# EAGLE schematic distillerone (EAGLE 9.6.2)
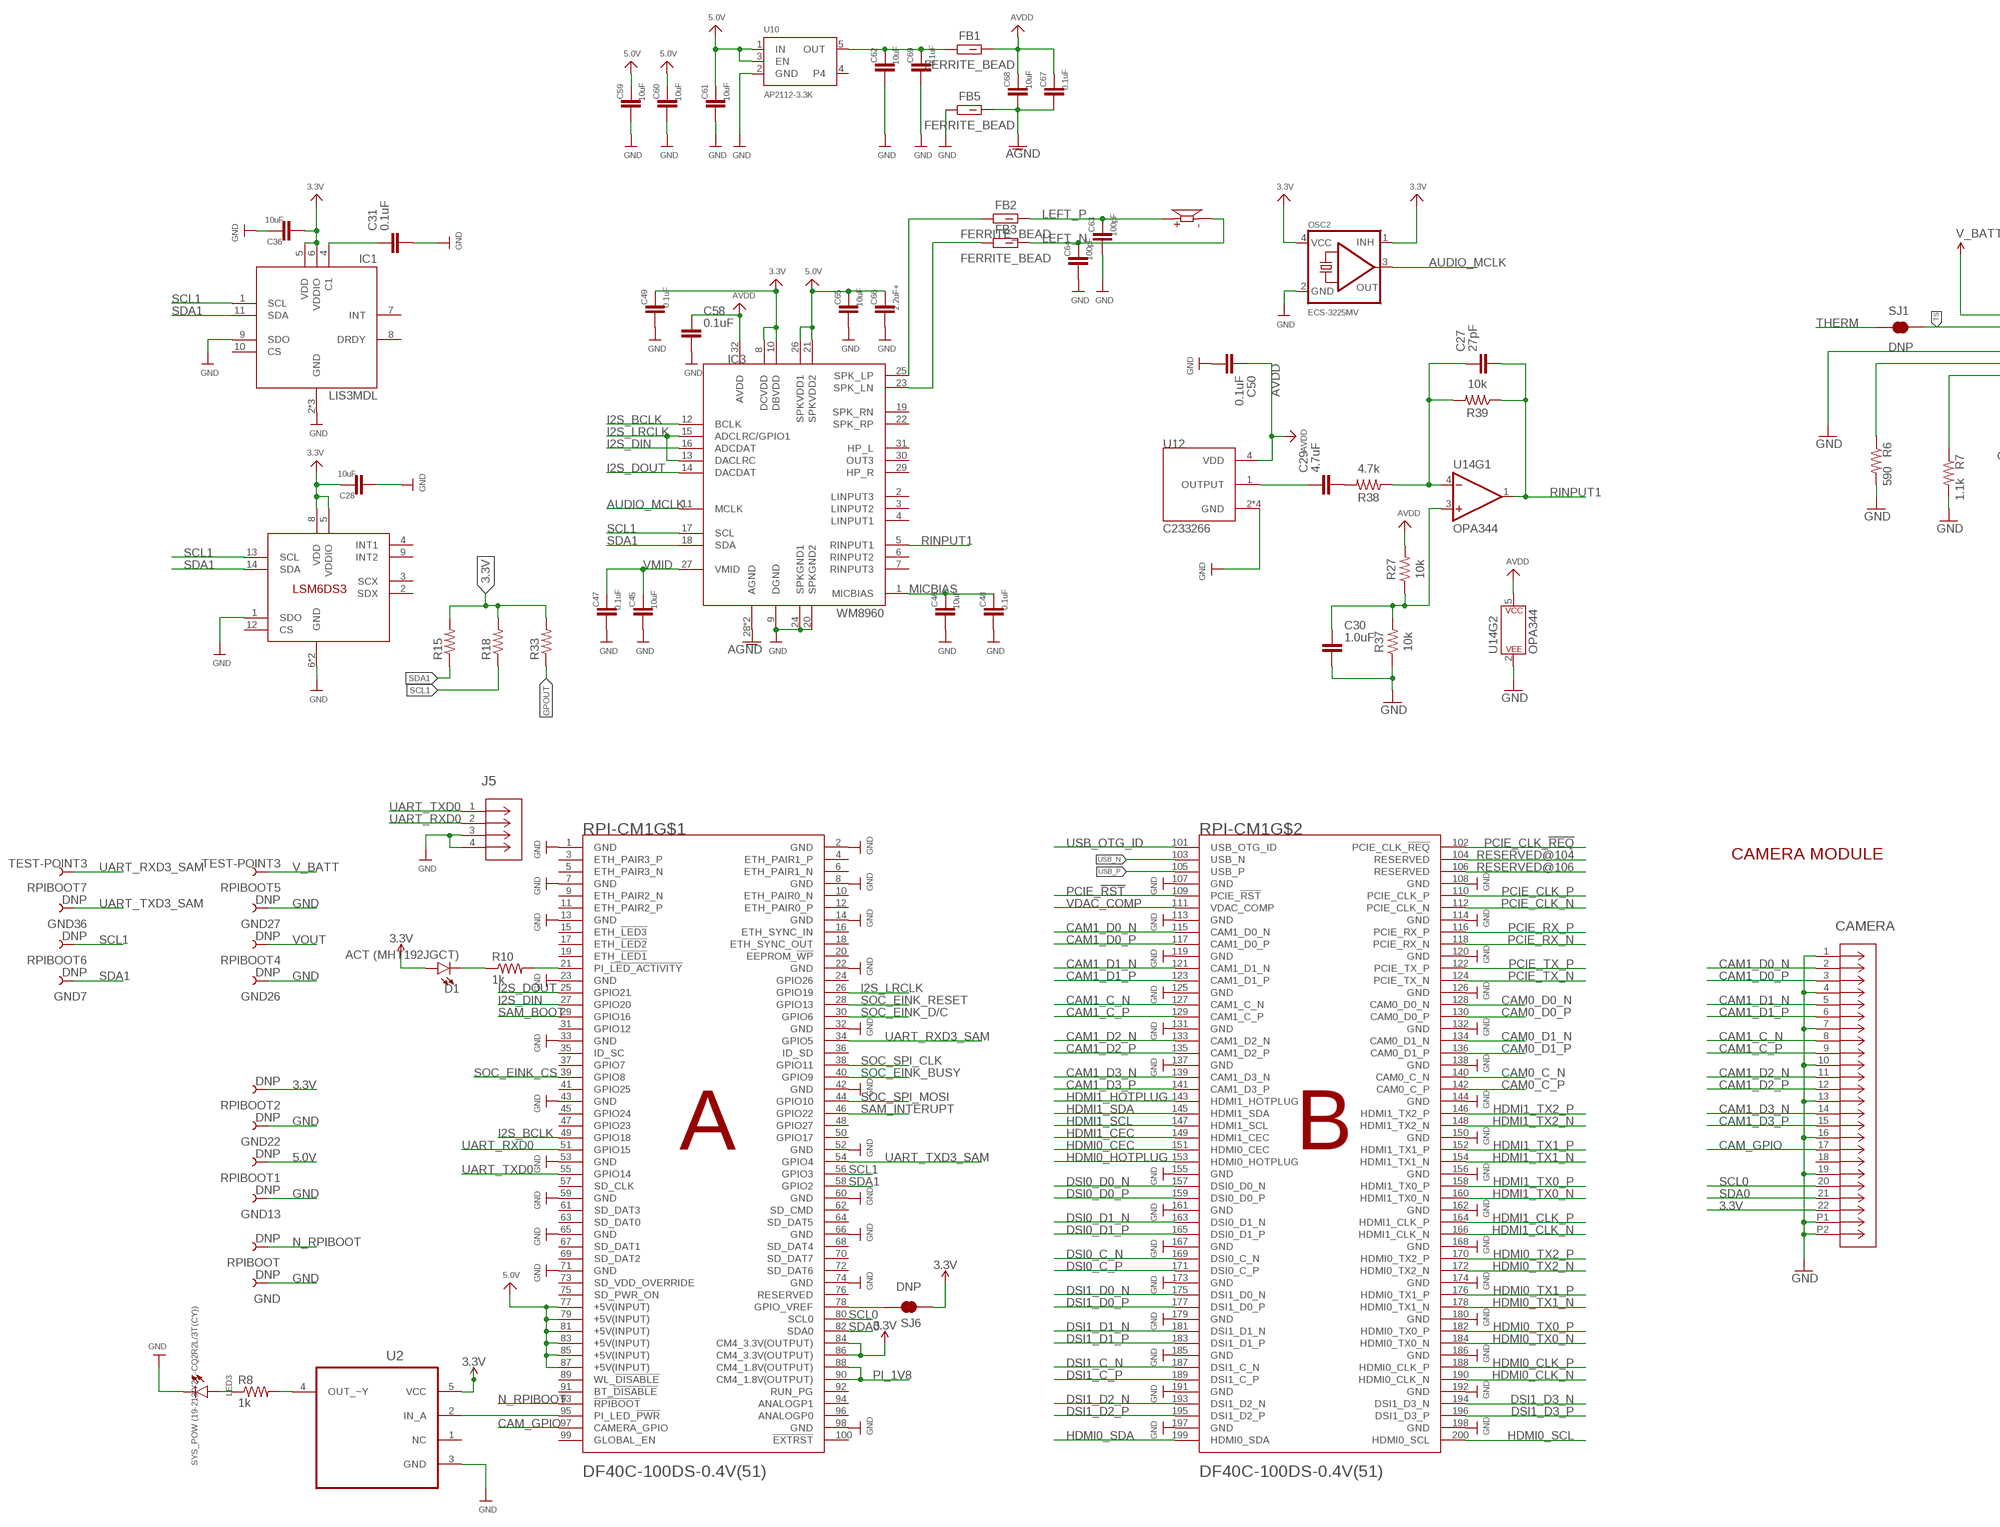
[diagram p0: schematic, sheet 1, part 1 of 3]
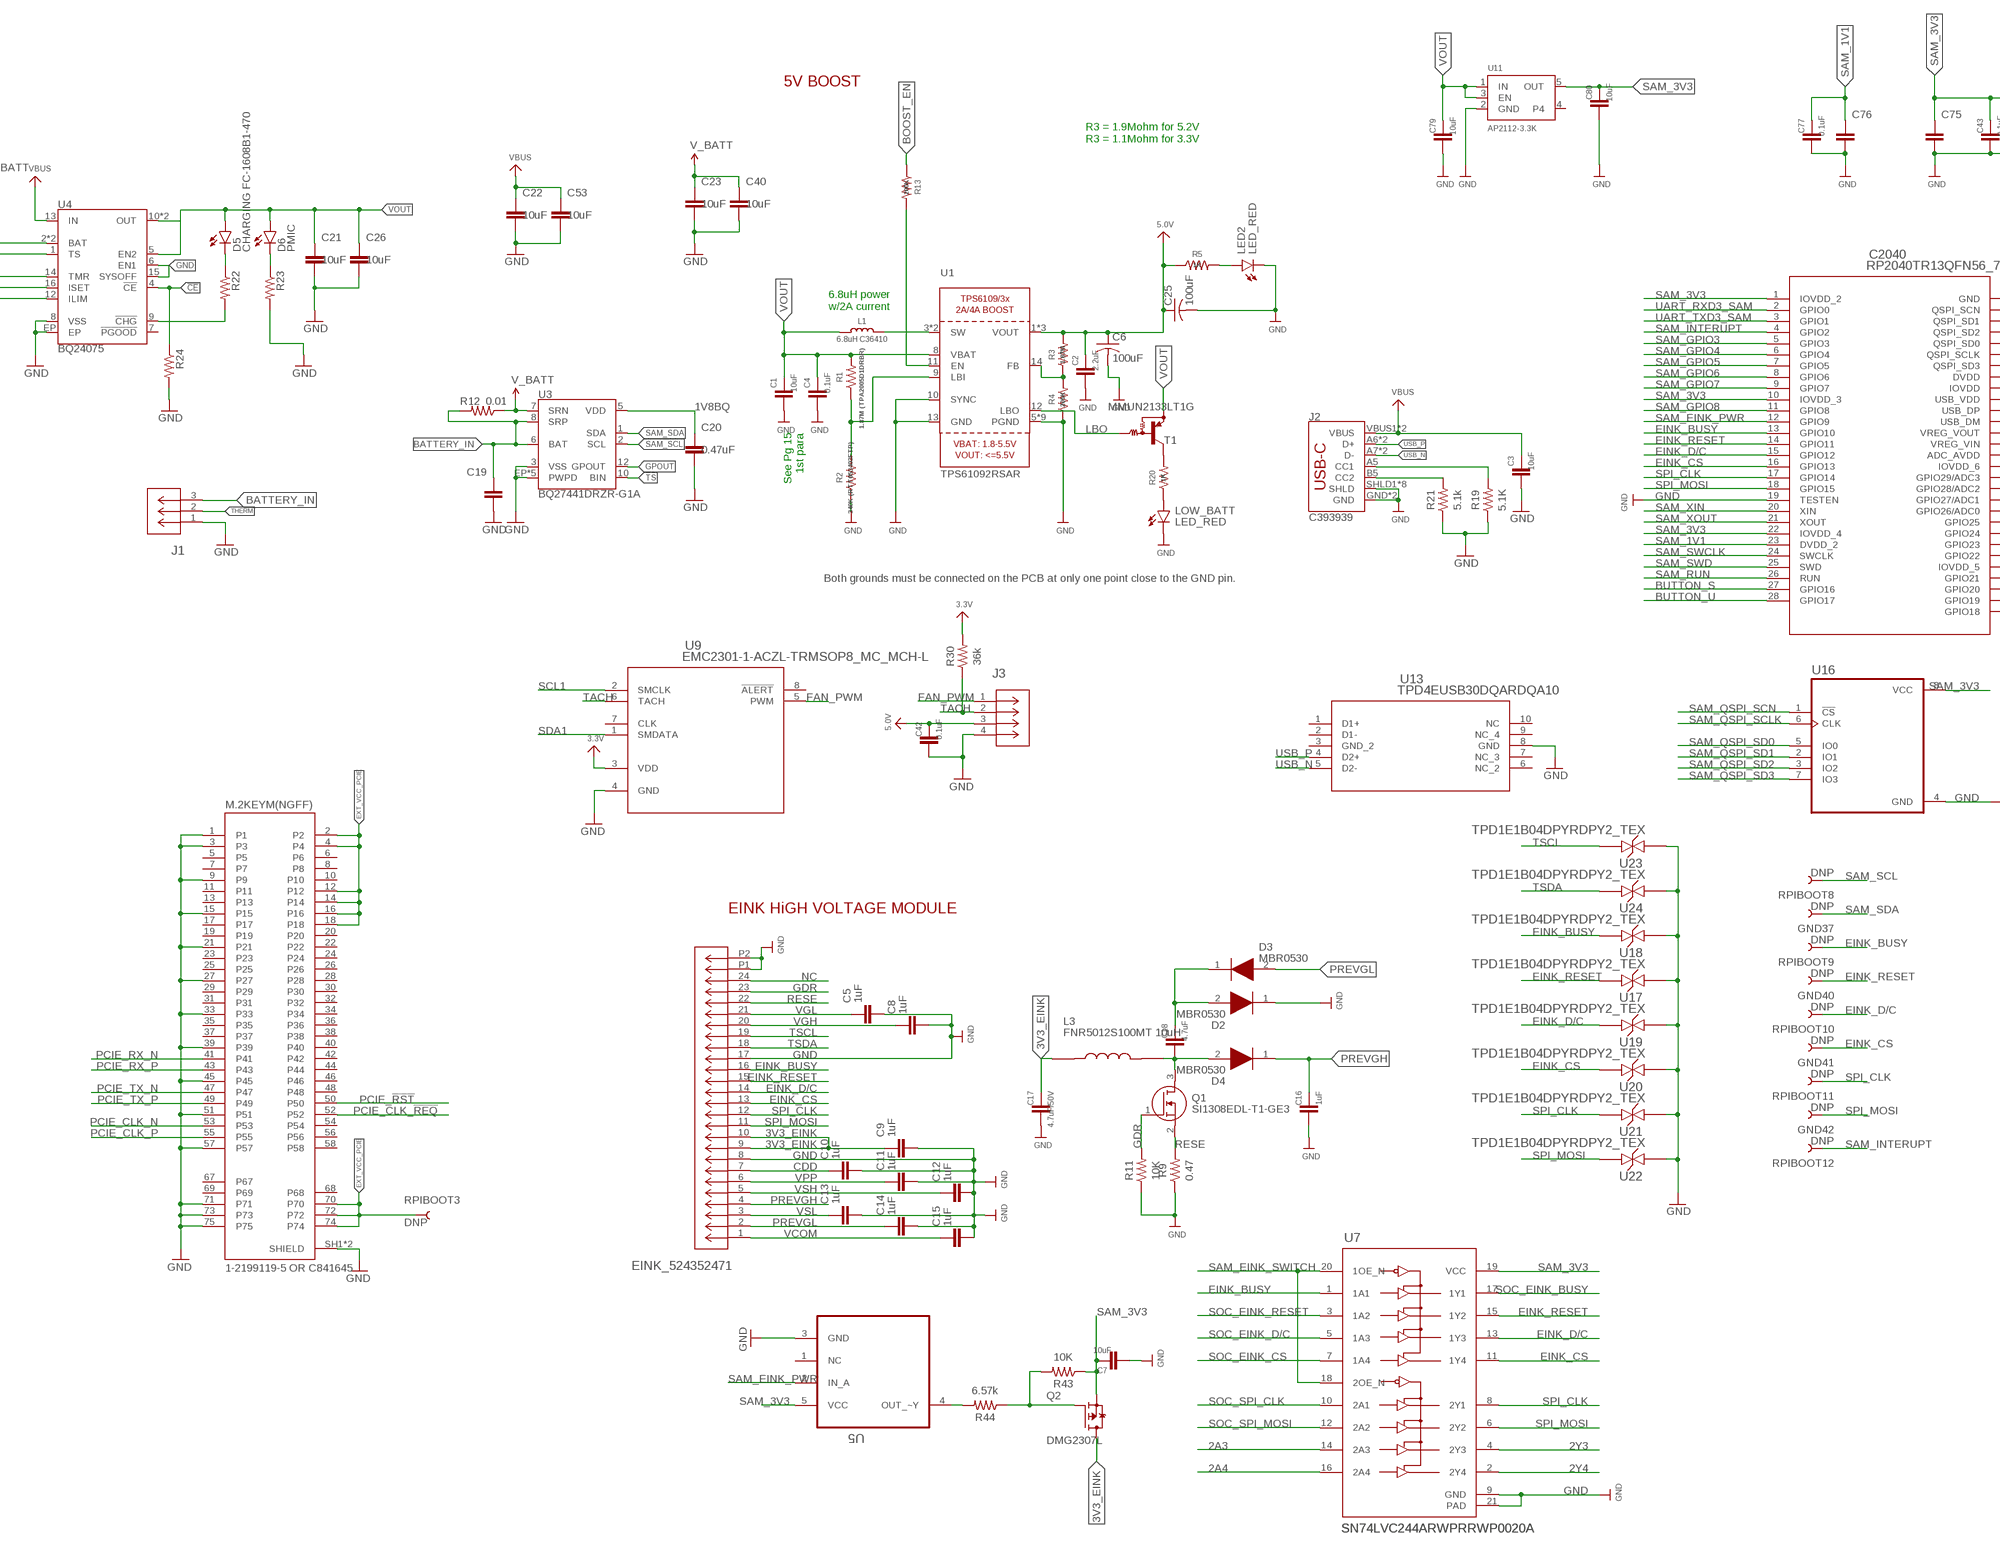
[diagram p1: schematic, sheet 1, part 2 of 3]
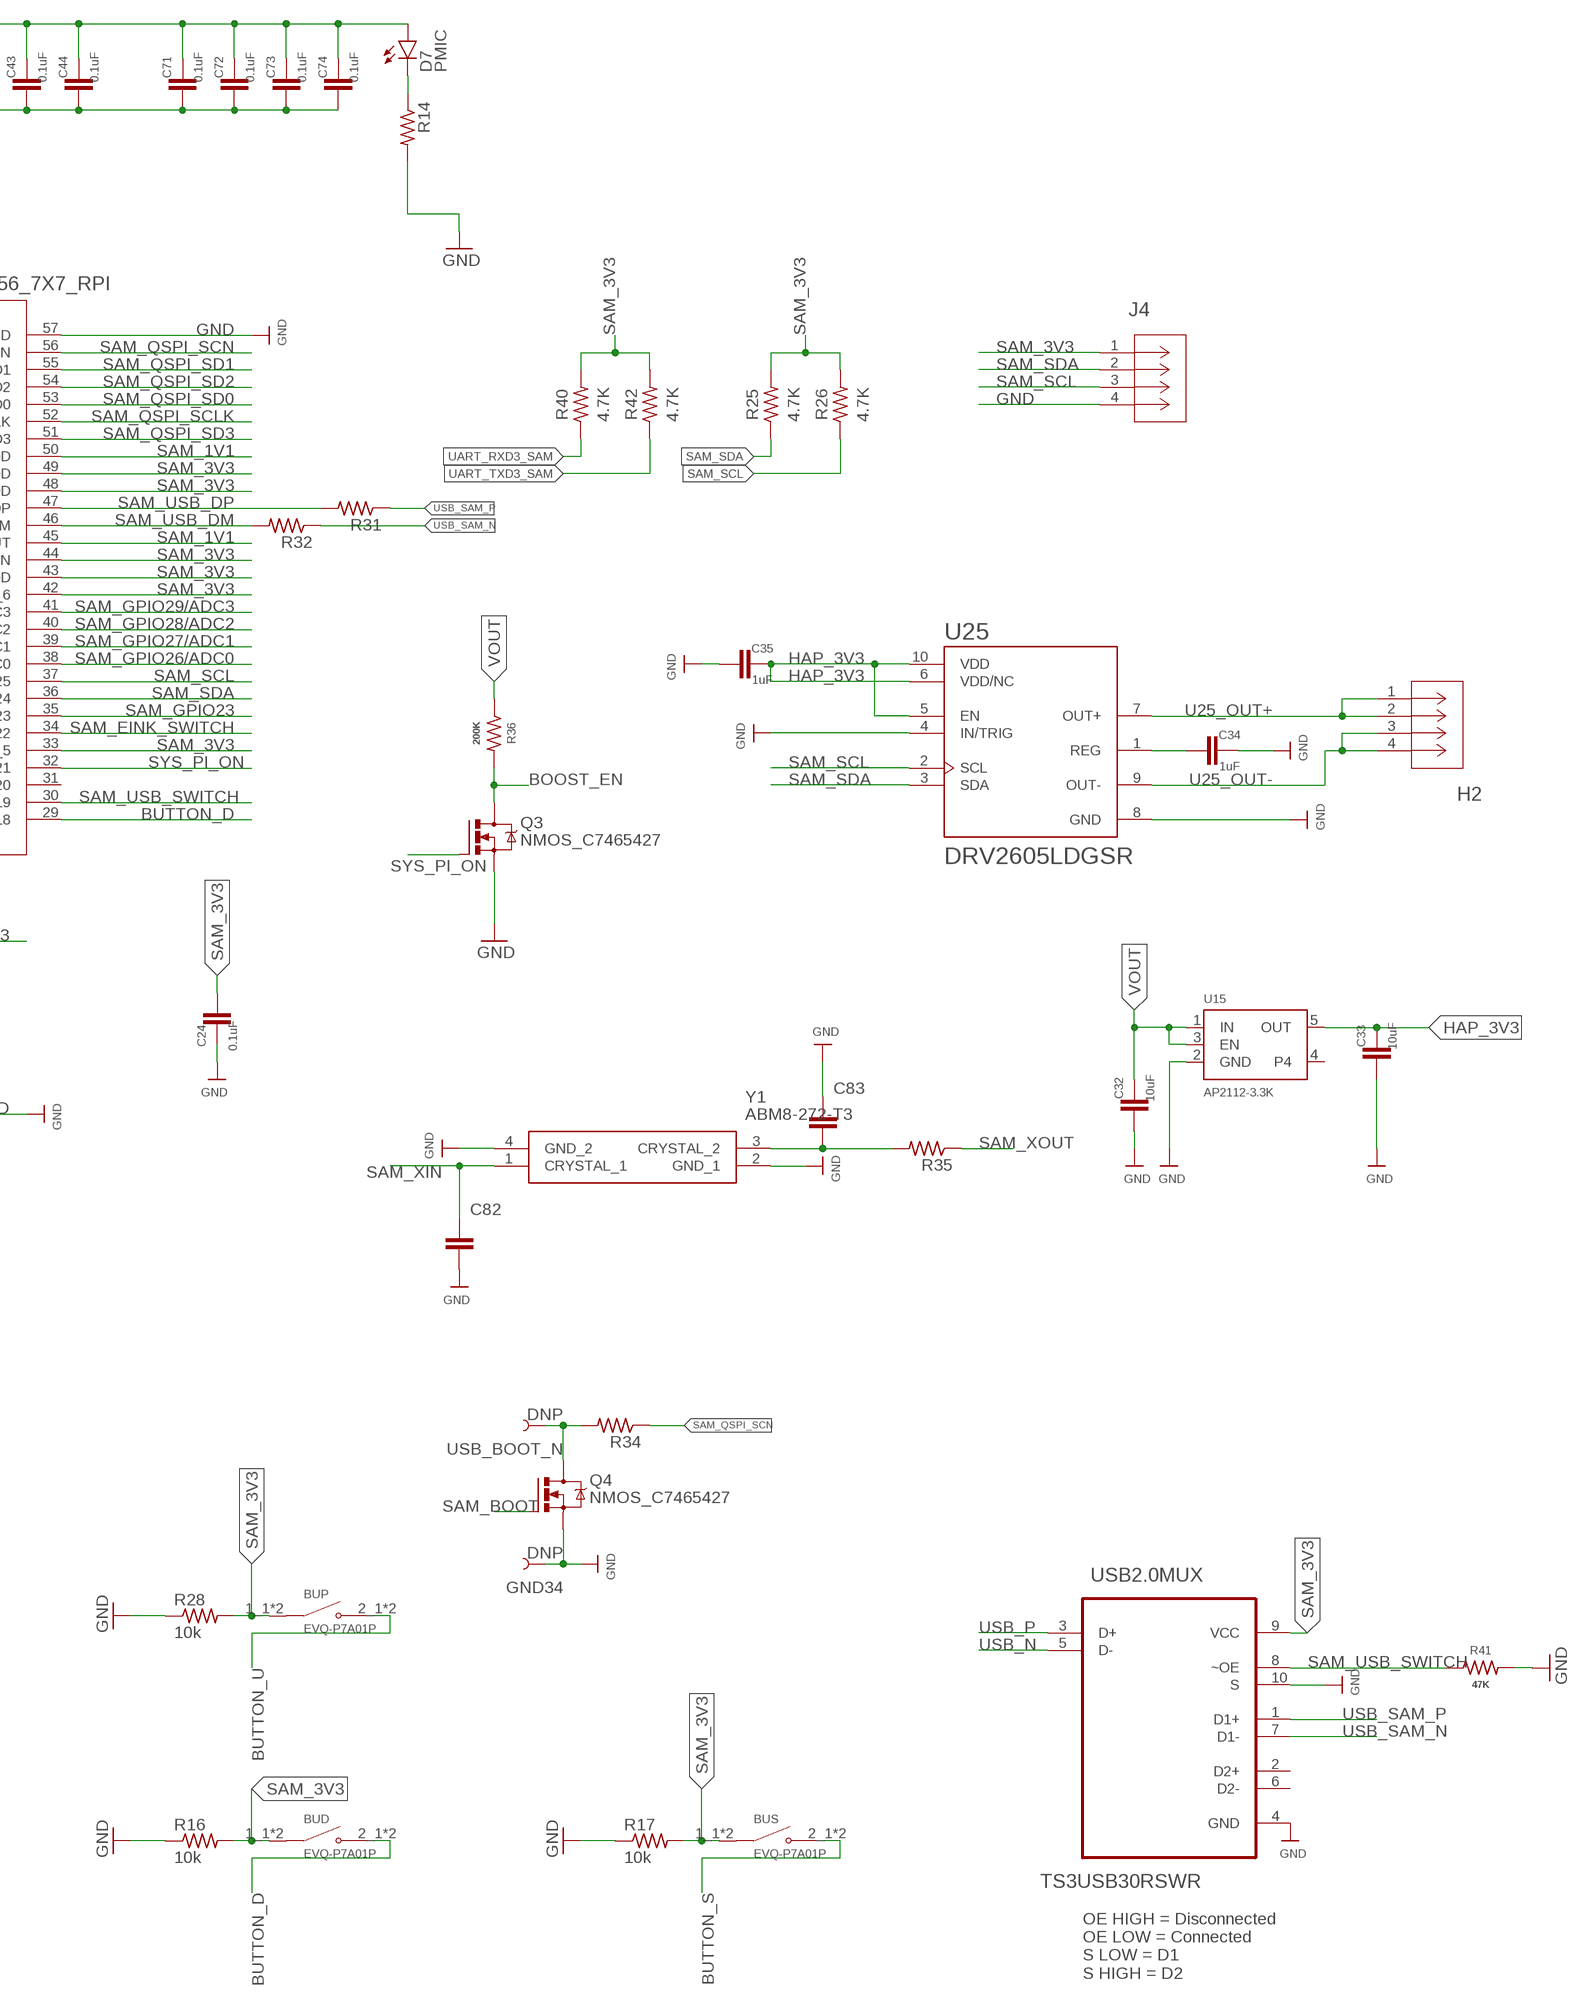
[diagram p2: schematic, sheet 1, part 3 of 3]

## Parts
BUD  EVQ-P7A01P  [SW_EVQ-P7A01P]
BUP  EVQ-P7A01P  [SW_EVQ-P7A01P]
BUS  EVQ-P7A01P  [SW_EVQ-P7A01P]
C1  10uF  C_CHIP-0402(1005-METRIC)  [CAPC1005X60]
C2  2.2uF  C_CHIP-0402(1005-METRIC)  [CAPC1005X60]
C3  10uF  C_CHIP-0402(1005-METRIC)  [CAPC1005X60]
C4  0.1uF  C_CHIP-0402(1005-METRIC)  [CAPC1005X60]
C5  1uF  C_CHIP-0402(1005-METRIC)  [CAPC1005X60]
C6  100uF  C-USC1210  [C1210]
C7  10uF  C_CHIP-0402(1005-METRIC)  [CAPC1005X60]
C8  1uF  C_CHIP-0402(1005-METRIC)  [CAPC1005X60]
C9  1uF  C_CHIP-0402(1005-METRIC)  [CAPC1005X60]
C10  1uF  C_CHIP-0402(1005-METRIC)  [CAPC1005X60]
C11  1uF  C_CHIP-0402(1005-METRIC)  [CAPC1005X60]
C12  1uF  C_CHIP-0402(1005-METRIC)  [CAPC1005X60]
C13  1uF  C_CHIP-0402(1005-METRIC)  [CAPC1005X60]
C14  1uF  C_CHIP-0402(1005-METRIC)  [CAPC1005X60]
C15  1uF  C_CHIP-0402(1005-METRIC)  [CAPC1005X60]
C16  1uF  C_CHIP-0402(1005-METRIC)  [CAPC1005X60]
C17  4.7uF/50V  C_CHIP-0402(1005-METRIC)  [CAPC1005X60]
C18  4.7uF  C_CHIP-0603(1608-METRIC)  [CAPC1608X85]
C19  1.0uF  C_CHIP-0402(1005-METRIC)  [CAPC1005X60]
C20  0.47uF  C_CHIP-0402(1005-METRIC)  [CAPC1005X60]
C21  10uF  C_CHIP-0402(1005-METRIC)  [CAPC1005X60]
C22  10uF  C_CHIP-0402(1005-METRIC)  [CAPC1005X60]
C23  10uF  C_CHIP-0402(1005-METRIC)  [CAPC1005X60]
C24  0.1uF  C_CHIP-0402(1005-METRIC)  [CAPC1005X60]
C25  100uF  C-USC1210  [C1210]
C26  10uF  C_CHIP-0402(1005-METRIC)  [CAPC1005X60]
C27  27pF  C_CHIP-0402(1005-METRIC)  [CAPC1005X60]
C28  10uF  C_CHIP-0402(1005-METRIC)  [CAPC1005X60]
C29  4.7uF  C_CHIP-0402(1005-METRIC)  [CAPC1005X60]
C30  1.0uF  C_CHIP-0402(1005-METRIC)  [CAPC1005X60]
C31  0.1uF  C_CHIP-0402(1005-METRIC)  [CAPC1005X60]
C32  10uF  C_CHIP-0402(1005-METRIC)  [CAPC1005X60]
C33  10uF  C_CHIP-0402(1005-METRIC)  [CAPC1005X60]
C34  1uF  C_CHIP-0402(1005-METRIC)  [CAPC1005X60]
C35  1uF  C_CHIP-0402(1005-METRIC)  [CAPC1005X60]
C36  10uF  C_CHIP-0402(1005-METRIC)  [CAPC1005X60]
C40  10uF  C_CHIP-0402(1005-METRIC)  [CAPC1005X60]
C42  0.1uF  C_CHIP-0603(1608-METRIC)  [CAPC1608X85]
C43  0.1uF  C_CHIP-0402(1005-METRIC)  [CAPC1005X60]
C44  0.1uF  C_CHIP-0402(1005-METRIC)  [CAPC1005X60]
C45  10uF  C_CHIP-0402(1005-METRIC)  [CAPC1005X60]
C46  10uF  C_CHIP-0402(1005-METRIC)  [CAPC1005X60]
C47  0.1uF  C_CHIP-0402(1005-METRIC)  [CAPC1005X60]
C48  0.1uF  C_CHIP-0402(1005-METRIC)  [CAPC1005X60]
C49  0.1uF  C_CHIP-0402(1005-METRIC)  [CAPC1005X60]
C50  0.1uF  C_CHIP-0402(1005-METRIC)  [CAPC1005X60]
C53  10uF  C_CHIP-0402(1005-METRIC)  [CAPC1005X60]
C58  0.1uF  C_CHIP-0402(1005-METRIC)  [CAPC1005X60]
C59  10uF  C_CHIP-0402(1005-METRIC)  [CAPC1005X60]
C60  10uF  C_CHIP-0402(1005-METRIC)  [CAPC1005X60]
C61  10uF  C_CHIP-0402(1005-METRIC)  [CAPC1005X60]
C62  10uF  C_CHIP-0402(1005-METRIC)  [CAPC1005X60]
C63  100pF  C_CHIP-0402(1005-METRIC)  [CAPC1005X60]
C64  100pF  C_CHIP-0402(1005-METRIC)  [CAPC1005X60]
C65  10uF  C_CHIP-0402(1005-METRIC)  [CAPC1005X60]
C66  2.2uF+  C_CHIP-0402(1005-METRIC)  [CAPC1005X60]
C67  0.1uF  C_CHIP-0402(1005-METRIC)  [CAPC1005X60]
C68  10uF  C_CHIP-0402(1005-METRIC)  [CAPC1005X60]
C69  0.1uF  C_CHIP-0402(1005-METRIC)  [CAPC1005X60]
C71  0.1uF  C_CHIP-0402(1005-METRIC)  [CAPC1005X60]
C72  0.1uF  C_CHIP-0402(1005-METRIC)  [CAPC1005X60]
C73  0.1uF  C_CHIP-0402(1005-METRIC)  [CAPC1005X60]
C74  0.1uF  C_CHIP-0402(1005-METRIC)  [CAPC1005X60]
C75  1.0uF  C_CHIP-0402(1005-METRIC)  [CAPC1005X60]
C76  1.0uF  C_CHIP-0402(1005-METRIC)  [CAPC1005X60]
C77  0.1uF  C_CHIP-0402(1005-METRIC)  [CAPC1005X60]
C79  10uF  C_CHIP-0402(1005-METRIC)  [CAPC1005X60]
C80  10uF  C_CHIP-0402(1005-METRIC)  [CAPC1005X60]
C82  15p  C_CHIP-0402(1005-METRIC)  [CAPC1005X60]
C83  15p  C_CHIP-0402(1005-METRIC)  [CAPC1005X60]
C2040  RP2040TR13QFN56_7X7_RPI  [QFN56_7X7_RPI]
CAMERA  C262642  524372271CON_524372271_MOL  [CON_524372271_MOL]
D1  ACT (MHT192JGCT)  LED-GREEN0603  [LED-0603@1]
D2  MBR0530  [SOD3716X135N]
D3  MBR0530  [SOD3716X135N]
D4  MBR0530  [SOD3716X135N]
D5  CHARGING FC-1608B1-470  LED-BLUE0603  [LED-0603]
D6  PMIC  LED-RED0603  [LED-0603]
D7  PMIC  LED-RED0603  [LED-0603]
EINK_524352471  524372471  524372471CON_524372471_MOL  [CON_524372471_MOL]
FB1  FERRITE_BEAD  FBCHIP-0603(1608-METRIC)  [BEADC1608X95N]
FB2  FERRITE_BEAD  FBCHIP-0603(1608-METRIC)  [BEADC1608X95N]
FB3  FERRITE_BEAD  FBCHIP-0603(1608-METRIC)  [BEADC1608X95N]
FB5  FERRITE_BEAD  FBCHIP-0603(1608-METRIC)  [BEADC1608X95N]
GND  DNP  TEST-POINT3  [PAD.03X.03]
GND7  DNP  TEST-POINT3  [PAD.03X.03]
GND13  DNP  TEST-POINT3  [PAD.03X.03]
GND22  DNP  TEST-POINT3  [PAD.03X.03]
GND26  DNP  TEST-POINT3  [PAD.03X.03]
GND27  DNP  TEST-POINT3  [PAD.03X.03]
GND34  DNP  TEST-POINT3  [PAD.03X.03]
GND36  DNP  TEST-POINT3  [PAD.03X.03]
GND37  DNP  TEST-POINT3  [PAD.03X.03]
GND40  DNP  TEST-POINT3  [PAD.03X.03]
GND41  DNP  TEST-POINT3  [PAD.03X.03]
GND42  DNP  TEST-POINT3  [PAD.03X.03]
H2  BM04B-SRSS-TBCONN4_BM04B-SRSS_JST  [CONN4_BM04B-SRSS_JST]
IC1  LIS3MDL  [LGA12_2X2MM]
IC3  WM8960  [QFN32_5MM]
J1  SM03B-SRSS-TBCONN_SM03B-SRSS-TB_JST  [CONN_SM03B-SRSS-TB_JST]
J2  C393939  USB_C16PIN  [USB-C-16P]
J3  BM04B-SRSS-TBCONN4_BM04B-SRSS_JST  [CONN4_BM04B-SRSS_JST]
J4  BM04B-SRSS-TBCONN4_BM04B-SRSS_JST  [CONN4_BM04B-SRSS_JST]
J5  BM04B-SRSS-TBCONN4_BM04B-SRSS_JST  [CONN4_BM04B-SRSS_JST]
L1  6.8uH C36410  INDUCTORTDK_VLC5045  [INDUCTOR_5X5MM_TDK_VLC5045]
L3  FNR5012S100MT 10uH  LQH5BPN2R2NT0L  [IND_LQH5BPN2R2NT0L]
LED2  LED_RED  CHIP-ROUND-R_0603  [LEDC1608X65N_RND-R]
LED3  SYS_POW (19-213/Y2C-CQ2R2L/3T(CY))  LED0603  [LED-0603]
LOW_BATT  LED_RED  CHIP-ROUND-R_0603  [LEDC1608X65N_RND-R]
LS1  CMS-18138A-SP  [CUI_CMS-18138A-SP]
M.2KEYM(NGFF)  1-2199119-5 OR C841645  1-2199119-5  [TE_1-2199119-5]
OSC2  ECS-3225MV  OSCILLATOR3.2X2.5  [OSC_3.2X2.5MM]
Q1  SI1308EDL-T1-GE3  [SOT65P210X110-3N]
Q2  DMG2307L  [SOT96P240X110-3N]
Q3  NMOS_C7465427  NMOSFETSOT23-GSD  [SOT23]
Q4  NMOS_C7465427  NMOSFETSOT23-GSD  [SOT23]
R1  1.87M (TPA2005D1DRBR)  R-US_CHIP-0402(1005-METRIC)  [RESC1005X40]
R2  340K (RTT053403FTP)  R-US_CHIP-0402(1005-METRIC)  [RESC1005X40]
R3  1.87M  R-US_CHIP-0402(1005-METRIC)  [RESC1005X40]
R4  200K  R-US_CHIP-0402(1005-METRIC)  [RESC1005X40]
R5  1K  R-US_CHIP-0402(1005-METRIC)  [RESC1005X40]
R6  590  R-US_CHIP-0402(1005-METRIC)  [RESC1005X40]
R7  1.1k  R-US_CHIP-0402(1005-METRIC)  [RESC1005X40]
R8  1k  R-US_CHIP-0402(1005-METRIC)  [RESC1005X40]
R9  0.47  R-US_CHIP-0402(1005-METRIC)  [RESC1005X40]
R10  1k  R-US_CHIP-0402(1005-METRIC)  [RESC1005X40]
R11  10K  R-US_CHIP-0402(1005-METRIC)  [RESC1005X40]
R12  0.01  RESISTOR1206  [1206]
R13  200K  R-US_CHIP-0402(1005-METRIC)  [RESC1005X40]
R14  1K  R-US_CHIP-0402(1005-METRIC)  [RESC1005X40]
R15  4.7K  R-US_CHIP-0402(1005-METRIC)  [RESC1005X40]
R16  10k  R-US_CHIP-0402(1005-METRIC)  [RESC1005X40]
R17  10k  R-US_CHIP-0402(1005-METRIC)  [RESC1005X40]
R18  4.7K  R-US_CHIP-0402(1005-METRIC)  [RESC1005X40]
R19  5.1K  R-US_CHIP-0402(1005-METRIC)  [RESC1005X40]
R20  1K  R-US_CHIP-0402(1005-METRIC)  [RESC1005X40]
R21  5.1k  R-US_CHIP-0402(1005-METRIC)  [RESC1005X40]
R22  180  R-US_CHIP-0402(1005-METRIC)  [RESC1005X40]
R23  1K  R-US_CHIP-0402(1005-METRIC)  [RESC1005X40]
R24  100k  R-US_CHIP-0402(1005-METRIC)  [RESC1005X40]
R25  4.7K  R-US_CHIP-0402(1005-METRIC)  [RESC1005X40]
R26  4.7K  R-US_CHIP-0402(1005-METRIC)  [RESC1005X40]
R27  10k  R-US_CHIP-0402(1005-METRIC)  [RESC1005X40]
R28  10k  R-US_CHIP-0402(1005-METRIC)  [RESC1005X40]
R30  36k  R-US_CHIP-0402(1005-METRIC)  [RESC1005X40]
R31  27  R-US_CHIP-0402(1005-METRIC)  [RESC1005X40]
R32  27  R-US_CHIP-0402(1005-METRIC)  [RESC1005X40]
R33  10K  R-US_CHIP-0402(1005-METRIC)  [RESC1005X40]
R34  1k  R-US_CHIP-0402(1005-METRIC)  [RESC1005X40]
R35  1k  R-US_CHIP-0402(1005-METRIC)  [RESC1005X40]
R36  200K  R-US_CHIP-0402(1005-METRIC)  [RESC1005X40]
R37  10k  R-US_CHIP-0402(1005-METRIC)  [RESC1005X40]
R38  4.7k  R-US_CHIP-0402(1005-METRIC)  [RESC1005X40]
R39  10k  R-US_CHIP-0402(1005-METRIC)  [RESC1005X40]
R40  4.7K  R-US_CHIP-0402(1005-METRIC)  [RESC1005X40]
R41  47K  R-US_CHIP-0402(1005-METRIC)  [RESC1005X40]
R42  4.7K  R-US_CHIP-0402(1005-METRIC)  [RESC1005X40]
R43  10K  R-US_CHIP-0402(1005-METRIC)  [RESC1005X40]
R44  6.57k  R-US_CHIP-0402(1005-METRIC)  [RESC1005X40]
RPI-CM1  DF40C-100DS-0.4V(51)  RPI-CM4  [RPI-CM4]
RPIBOOT  DNP  TEST-POINT3  [PAD.03X.03]
RPIBOOT1  DNP  TEST-POINT3  [PAD.03X.03]
RPIBOOT2  DNP  TEST-POINT3  [PAD.03X.03]
RPIBOOT3  DNP  TEST-POINT3  [PAD.03X.03]
RPIBOOT4  DNP  TEST-POINT3  [PAD.03X.03]
RPIBOOT5  TEST-POINT3  [PAD.03X.03]
RPIBOOT6  DNP  TEST-POINT3  [PAD.03X.03]
RPIBOOT7  TEST-POINT3  [PAD.03X.03]
RPIBOOT8  DNP  TEST-POINT3  [PAD.03X.03]
RPIBOOT9  DNP  TEST-POINT3  [PAD.03X.03]
RPIBOOT10  DNP  TEST-POINT3  [PAD.03X.03]
RPIBOOT11  DNP  TEST-POINT3  [PAD.03X.03]
RPIBOOT12  DNP  TEST-POINT3  [PAD.03X.03]
SJ1  DNP  JUMPER-PAD-2-NC_BY_TRACE  [PAD-JUMPER-2-NC_BY_TRACE_YES_SILK]
SJ6  DNP  JUMPER-PAD-2-NC_BY_TRACE  [PAD-JUMPER-2-NC_BY_TRACE_YES_SILK]
T1  MMUN2133LT1G  MUN2114T1-PNP_DRIVER-SC59-BEC  [SC59-BEC]
U1  TPS61092RSAR  VREG_TPS6103X  [PVQFN-16]
U2  MC74VHC1G14DFT1G  [SOT65P210X110-5N]
U3  BQ27441DRZR-G1A  BQ27441-G1  [PDSO-N12]
U4  BQ24075  [PVQFN-N16]
U5  MC74VHC1G14DFT1G OR C66196  MC74VHC1G14DFT1G  [SOT65P210X110-5N]
U6  LSM6DS3  [LGA-14L]
U7  SN74LVC244ARWPRRWP0020A  [RWP0020A]
U9  EMC2301-1-ACZL-TRMSOP8_MC_MCH-L  [MSOP8_MC_MCH-L]
U10  AP2112-3.3K  VREG_SOT23-5  [SOT23-5]
U11  AP2112-3.3K  VREG_SOT23-5  [SOT23-5]
U12  C233266  SPU0410LR5H-QB  [XDCR_SPU0410LR5H-QB]
U13  TPD4EUSB30DQARDQA10  [DQA10]
U14  OPA344  [SOT23-5]
U15  AP2112-3.3K  VREG_SOT23-5  [SOT23-5]
U16  W25Q16JVUXIQ_TR  [PSON50P300X200X60-9N]
U17  TPD1E1B04DPYRDPY2_TEX  [DPY2_TEX]
U18  TPD1E1B04DPYRDPY2_TEX  [DPY2_TEX]
U19  TPD1E1B04DPYRDPY2_TEX  [DPY2_TEX]
U20  TPD1E1B04DPYRDPY2_TEX  [DPY2_TEX]
U21  TPD1E1B04DPYRDPY2_TEX  [DPY2_TEX]
U22  TPD1E1B04DPYRDPY2_TEX  [DPY2_TEX]
U23  TPD1E1B04DPYRDPY2_TEX  [DPY2_TEX]
U24  TPD1E1B04DPYRDPY2_TEX  [DPY2_TEX]
U25  DRV2605LDGSR  [SOP50P490X110-10N]
USB2.0MUX  TS3USB30RSWR  [10-UFQFN]
USB_BOOT_N  DNP  TEST-POINT3  [PAD.03X.03]
Y1  ABM8-272-T3  [ABM8272T3]

## Nets
1V8BQ: C20.1 U3.5(VDD)
2A3: U7.14(2A3)
2A4: U7.16(2A4)
2Y3: U7.4(2Y3)
2Y4: U7.2(2Y4)
3.3V: C28.1 C36.2 C49.1 CAMERA.22 D1.A IC1.5(VDD) IC1.6(VDDIO) IC3.8(DCVDD) IC3.10(DBVDD) OSC2.1(INH) OSC2.4(VCC) R15.2 R18.2 R30.2 R33.2 RPI-CM1.84(CM4_3.3V(OUTPUT)) RPI-CM1.86(CM4_3.3V(OUTPUT)) RPIBOOT2.P$1 SJ6.1 U2.5(VCC) U6.5(VDDIO) U6.8(VDD) U9.3(VDD)
3V3_EINK: C9.1 C17.1 EINK_524352471.9 EINK_524352471.10 L3.1 Q2.3(D)
5.0V: C2.1 C6.1 C25.1 C42.1 C59.1 C60.1 C61.1 C65.1 C66.1 IC3.21(SPKVDD2) IC3.26(SPKVDD1) J3.3 R3.2 R5.1 RPI-CM1.77(+5V(INPUT)) RPI-CM1.79(+5V(INPUT)) RPI-CM1.81(+5V(INPUT)) RPI-CM1.83(+5V(INPUT)) RPI-CM1.85(+5V(INPUT)) RPI-CM1.87(+5V(INPUT)) RPIBOOT1.P$1 U1.1(VOUT) U1.15(VOUT) U1.16(VOUT) U10.1(IN) U10.3(EN)
!CE!: R24.1 U4.4(!CE!)
!CHG!: R22.2 U4.9(!CHG!)
AGND: C67.2 C68.2 FB5.2 IC3.28(AGND) IC3.33(AGND)
AUDIO_MCLK: IC3.11(MCLK) OSC2.3(OUT)
AVDD: C50.1 C58.1 C67.1 C68.1 FB1.2 IC3.32(AVDD) R27.2 U12.4(VDD) U14.5(P$V+)
BATTERY_IN [BUS]: C19.1 J1.3 R12.2 U3.6(BAT) U3.8(SRP)
BOOST_EN: Q3.3(D) R13.1 R36.2
BUTTON_D: BUD.2_1 BUD.2_2 C2040.29(GPIO18)
BUTTON_S: BUS.2_1 BUS.2_2 C2040.27(GPIO16)
BUTTON_U: BUP.2_1 BUP.2_2 C2040.28(GPIO17)
CAM0_C_N: RPI-CM1.140(CAM0_C_N)
CAM0_C_P: RPI-CM1.142(CAM0_C_P)
CAM0_D0_N: RPI-CM1.128(CAM0_D0_N)
CAM0_D0_P: RPI-CM1.130(CAM0_D0_P)
CAM0_D1_N: RPI-CM1.134(CAM0_D1_N)
CAM0_D1_P: RPI-CM1.136(CAM0_D1_P)
CAM1_C_N [PCIEs]: CAMERA.8 RPI-CM1.127(CAM1_C_N)
CAM1_C_P [PCIEs]: CAMERA.9 RPI-CM1.129(CAM1_C_P)
CAM1_D0_N [PCIEs]: CAMERA.2 RPI-CM1.115(CAM1_D0_N)
CAM1_D0_P [PCIEs]: CAMERA.3 RPI-CM1.117(CAM1_D0_P)
CAM1_D1_N [PCIEs]: CAMERA.5 RPI-CM1.121(CAM1_D1_N)
CAM1_D1_P [PCIEs]: CAMERA.6 RPI-CM1.123(CAM1_D1_P)
CAM1_D2_N [PCIEs]: CAMERA.11 RPI-CM1.133(CAM1_D2_N)
CAM1_D2_P [PCIEs]: CAMERA.12 RPI-CM1.135(CAM1_D2_P)
CAM1_D3_N [PCIEs]: CAMERA.14 RPI-CM1.139(CAM1_D3_N)
CAM1_D3_P [PCIEs]: CAMERA.15 RPI-CM1.141(CAM1_D3_P)
CAM_GPIO: CAMERA.17 RPI-CM1.97(CAMERA_GPIO)
CDD: C10.1 EINK_524352471.7
DSI0_C_N: RPI-CM1.169(DSI0_C_N)
DSI0_C_P: RPI-CM1.171(DSI0_C_P)
DSI0_D0_N: RPI-CM1.157(DSI0_D0_N)
DSI0_D0_P: RPI-CM1.159(DSI0_D0_P)
DSI0_D1_N: RPI-CM1.163(DSI0_D1_N)
DSI0_D1_P: RPI-CM1.165(DSI0_D1_P)
DSI1_C_N: RPI-CM1.187(DSI1_C_N)
DSI1_C_P: RPI-CM1.189(DSI1_C_P)
DSI1_D0_N: RPI-CM1.175(DSI1_D0_N)
DSI1_D0_P: RPI-CM1.177(DSI1_D0_P)
DSI1_D1_N: RPI-CM1.181(DSI1_D1_N)
DSI1_D1_P: RPI-CM1.183(DSI1_D1_P)
DSI1_D2_N: RPI-CM1.193(DSI1_D2_N)
DSI1_D2_P: RPI-CM1.195(DSI1_D2_P)
DSI1_D3_N: RPI-CM1.194(DSI1_D3_N)
DSI1_D3_P: RPI-CM1.196(DSI1_D3_P)
EINK_BUSY: C2040.13(GPIO10) EINK_524352471.16 RPIBOOT9.P$1 U7.1(1A1) U18.2(I/O)
EINK_CS: C2040.16(GPIO13) EINK_524352471.13 GND41.P$1 U7.11(1Y4) U20.2(I/O)
EINK_D/C: C2040.15(GPIO12) EINK_524352471.14 RPIBOOT10.P$1 U7.13(1Y3) U19.2(I/O)
EINK_RESET: C2040.14(GPIO11) EINK_524352471.15 GND40.P$1 U7.15(1Y2) U17.2(I/O)
ENABLE: R13.2 U1.11(EN)
EXT_VCC_PCIE: M.2KEYM(NGFF).2 M.2KEYM(NGFF).4 M.2KEYM(NGFF).12 M.2KEYM(NGFF).14 M.2KEYM(NGFF).16 M.2KEYM(NGFF).18 M.2KEYM(NGFF).70 M.2KEYM(NGFF).72 M.2KEYM(NGFF).74 RPIBOOT3.P$1
FAN_PWM: J3.1 U9.5(PWM)
GDR: EINK_524352471.23 Q1.1(G) R11.2
GND: C1.2 C2.2 C3.2 C4.2 C5.2 C6.2 C7.2 C8.2 C9.2 C10.2 C11.2 C12.2 C13.2 C14.2 C15.2 C16.2 C17.2 C19.2 C20.2 C21.2 C22.2 C23.2 C24.1 C25.2 C26.2 C28.2 C30.2 C31.2 C32.2 C33.2 C34.1 C35.2 C36.1 C40.2 C42.2 C43.2 C44.2 C45.2 C46.2 C47.2 C48.2 C49.2 C50.2 C53.2 C58.2 C59.2 C60.2 C61.2 C62.2 C63.2 C64.2 C65.2 C66.2 C69.2 C71.2 C72.2 C73.2 C74.2 C75.2 C76.2 C77.2 C79.2 C80.2 C82.2 C83.1 C2040.19(TESTEN) C2040.57(GND) CAMERA.1 CAMERA.4 CAMERA.7 CAMERA.10 CAMERA.13 CAMERA.16 CAMERA.19 CAMERA.P1 CAMERA.P2 D2.1(K) EINK_524352471.8 EINK_524352471.17 EINK_524352471.P1 EINK_524352471.P2 FB5.1 GND13.P$1 GND22.P$1 GND26.P$1 GND27.P$1 GND34.P$1 GND.P$1 IC1.2(GND) IC1.3(GND) IC1.9(SDO) IC1.12(GND) IC3.9(DGND) IC3.20(SPKGND2) IC3.24(SPKGND1) J1.1 J2.GND J2.GND2(GND) J2.SHLD1(SHLD) J2.SHLD2(SHLD) J2.SHLD3(SHLD) J2.SHLD4(SHLD) J2.SHLD5(SHLD) J2.SHLD6(SHLD) J2.SHLD7(SHLD) J2.SHLD8(SHLD) J3.4 J4.4 J5.3 J5.4 LED2.C LED3.C LOW_BATT.C M.2KEYM(NGFF).1 M.2KEYM(NGFF).3 M.2KEYM(NGFF).9 M.2KEYM(NGFF).15 M.2KEYM(NGFF).21 M.2KEYM(NGFF).27 M.2KEYM(NGFF).33 M.2KEYM(NGFF).39 M.2KEYM(NGFF).45 M.2KEYM(NGFF).51 M.2KEYM(NGFF).57 M.2KEYM(NGFF).71 M.2KEYM(NGFF).73 M.2KEYM(NGFF).75 M.2KEYM(NGFF).SH1(SHIELD) M.2KEYM(NGFF).SH2(SHIELD) OSC2.2(GND) Q3.2(S) Q4.2(S) R2.1 R4.1 R6.2 R7.2 R9.1 R11.1 R14.2 R16.1 R17.1 R19.1 R21.1 R23.2 R24.2 R28.1 R37.1 R41.2 RPI-CM1.1(GND) RPI-CM1.2(GND) RPI-CM1.7(GND) RPI-CM1.8(GND) RPI-CM1.13(GND) RPI-CM1.14(GND) RPI-CM1.22(GND) RPI-CM1.23(GND) RPI-CM1.32(GND) RPI-CM1.33(GND) RPI-CM1.42(GND) RPI-CM1.43(GND) RPI-CM1.52(GND) RPI-CM1.53(GND) RPI-CM1.59(GND) RPI-CM1.60(GND) RPI-CM1.65(GND) RPI-CM1.66(GND) RPI-CM1.71(GND) RPI-CM1.74(GND) RPI-CM1.98(GND) RPI-CM1.107(GND) RPI-CM1.108(GND) RPI-CM1.113(GND) RPI-CM1.114(GND) RPI-CM1.119(GND) RPI-CM1.120(GND) RPI-CM1.125(GND) RPI-CM1.126(GND) RPI-CM1.131(GND) RPI-CM1.132(GND) RPI-CM1.137(GND) RPI-CM1.138(GND) RPI-CM1.144(GND) RPI-CM1.150(GND) RPI-CM1.155(GND) RPI-CM1.156(GND) RPI-CM1.161(GND) RPI-CM1.162(GND) RPI-CM1.167(GND) RPI-CM1.168(GND) RPI-CM1.173(GND) RPI-CM1.174(GND) RPI-CM1.179(GND) RPI-CM1.180(GND) RPI-CM1.185(GND) RPI-CM1.186(GND) RPI-CM1.191(GND) RPI-CM1.192(GND) RPI-CM1.197(GND) RPI-CM1.198(GND) U1.5(PGND) U1.6(PGND) U1.7(PGND) U1.10(SYNC) U1.13(GND) U1.P$18(PGND) U1.P$19(PGND) U1.P$20(PGND) U1.P$21(PGND) U1.P$22(PGND) U1.THERMAL(PGND) U2.3(GND) U3.3(VSS) U3.EP1(PWPD) U3.EP2(PWPD) U3.EP3(PWPD) U3.EP4(PWPD) U3.EP(PWPD) U4.6(EN1) U4.8(VSS) U4.14(TMR) U4.15(SYSOFF) U4.EP U5.3(GND) U6.1(SDO) U6.6(GND) U6.7(GND) U7.9(GND) U7.21(PAD) U9.4(GND) U10.2(GND) U11.2(GND) U12.2(GND) U12.3(GND) U12.5(GND) U12.6(GND) U13.8(GND) U14.2(P$V-) U15.2(GND) U16.4(GND) U17.1(I/O_2) U18.1(I/O_2) U19.1(I/O_2) U20.1(I/O_2) U21.1(I/O_2) U22.1(I/O_2) U23.1(I/O_2) U24.1(I/O_2) U25.4(IN/TRIG) U25.8(GND) USB2.0MUX.4(GND) USB2.0MUX.10(S) Y1.2(GND_1) Y1.4(GND_2)
GPOUT: R33.1 U3.12(GPOUT)
HAP_3V3: C33.1 C35.1 U15.5(OUT) U25.5(EN) U25.6(VDD/NC) U25.10(VDD)
HDMI0_CEC: RPI-CM1.151(HDMI0_CEC)
HDMI0_CLK_N: RPI-CM1.190(HDMI0_CLK_N)
HDMI0_CLK_P: RPI-CM1.188(HDMI0_CLK_P)
HDMI0_HOTPLUG: RPI-CM1.153(HDMI0_HOTPLUG)
HDMI0_SCL: RPI-CM1.200(HDMI0_SCL)
HDMI0_SDA: RPI-CM1.199(HDMI0_SDA)
HDMI0_TX0_N: RPI-CM1.184(HDMI0_TX0_N)
HDMI0_TX0_P: RPI-CM1.182(HDMI0_TX0_P)
HDMI0_TX1_N: RPI-CM1.178(HDMI0_TX1_N)
HDMI0_TX1_P: RPI-CM1.176(HDMI0_TX1_P)
HDMI0_TX2_N: RPI-CM1.172(HDMI0_TX2_N)
HDMI0_TX2_P: RPI-CM1.170(HDMI0_TX2_P)
HDMI1_CEC: RPI-CM1.149(HDMI1_CEC)
HDMI1_CLK_N: RPI-CM1.166(HDMI1_CLK_N)
HDMI1_CLK_P: RPI-CM1.164(HDMI1_CLK_P)
HDMI1_HOTPLUG: RPI-CM1.143(HDMI1_HOTPLUG)
HDMI1_SCL: RPI-CM1.147(HDMI1_SCL)
HDMI1_SDA: RPI-CM1.145(HDMI1_SDA)
HDMI1_TX0_N: RPI-CM1.160(HDMI1_TX0_N)
HDMI1_TX0_P: RPI-CM1.158(HDMI1_TX0_P)
HDMI1_TX1_N: RPI-CM1.154(HDMI1_TX1_N)
HDMI1_TX1_P: RPI-CM1.152(HDMI1_TX1_P)
HDMI1_TX2_N: RPI-CM1.148(HDMI1_TX2_N)
HDMI1_TX2_P: RPI-CM1.146(HDMI1_TX2_P)
I2S_BCLK: IC3.12(BCLK) RPI-CM1.49(GPIO18)
I2S_DIN: IC3.16(ADCDAT) RPI-CM1.27(GPIO20)
I2S_DOUT: IC3.14(DACDAT) RPI-CM1.25(GPIO21)
I2S_LRCLK: IC3.13(DACLRC) IC3.15(ADCLRC/GPIO1) RPI-CM1.26(GPIO19)
ILIM: R7.1 U4.12(ILIM)
ISET: R6.1 U4.16(ISET)
LBO: T1.B U1.12(LBO)
LEFT_N: C64.1 FB3.2 LS1.N
LEFT_P: C63.1 FB2.2 LS1.P
MICBIAS: C46.1 C48.1 IC3.1(MICBIAS)
N$1: L1.P$2 U1.3(SW) U1.4(SW)
N$2: LOW_BATT.A R20.1
N$3: R1.1 R2.2 U1.9(LBI)
N$4: LED2.A R5.2
N$5: R3.1 R4.2 U1.14(FB)
N$6: R20.2 T1.C
N$7: RPI-CM1.78(GPIO_VREF) SJ6.2
N$8: C31.1 IC1.4(C1)
N$9: RPI-CM1.95(PI_LED_!PWR) U2.2(IN_A)
N$10: C29.1 U12.1(OUTPUT)
N$11: R8.2 U2.4(OUT_~Y)
N$12: LED3.A R8.1
N$13: C27.1 R38.1 R39.2 U14.4(-IN)
N$14: R10.2 RPI-CM1.21(PI_!LED_ACTIVITY)
N$15: D1.C R10.1
N$16: C34.2 U25.1(REG)
N$17: D5.C R22.1
N$18: D7.C R14.1
N$19: C18.1 D2.2(A) D3.1(K)
N$20: C29.2 R38.2
N$21: D6.C R23.1
N$22: C30.1 R27.1 R37.2 U14.3(+IN)
N$23: C18.2 D4.2(A) L3.2 Q1.3(D)
N$24: Q4.3(D) R34.2 USB_BOOT_N.P$1
N$26: C83.2 R35.2 Y1.3(CRYSTAL_2)
N$27: J2.B5(CC2) R21.2
N$28: Q2.1(G) R43.2 R44.1
N$29: R44.2 U5.4(OUT_~Y)
N$30: J2.A5(CC1) R19.2
N$40: FB2.1 IC3.25(SPK_LP)
N$41: FB3.1 IC3.23(SPK_LN)
N_RPIBOOT: RPI-CM1.93(!RPIBOOT) RPIBOOT.P$1
NC: EINK_524352471.24
OUT: C62.1 C69.1 FB1.1 U10.5(OUT)
PCIE_!RST [PCIEs]: M.2KEYM(NGFF).50 RPI-CM1.109(PCIE_!RST)
PCIE_CLK_!REQ [PCIEs]: M.2KEYM(NGFF).52 RPI-CM1.102(PCIE_CLK_!REQ)
PCIE_CLK_N [PCIEs]: M.2KEYM(NGFF).53 RPI-CM1.112(PCIE_CLK_N)
PCIE_CLK_P [PCIEs]: M.2KEYM(NGFF).55 RPI-CM1.110(PCIE_CLK_P)
PCIE_RX_N [PCIEs]: M.2KEYM(NGFF).41 RPI-CM1.118(PCIE_RX_N)
PCIE_RX_P [PCIEs]: M.2KEYM(NGFF).43 RPI-CM1.116(PCIE_RX_P)
PCIE_TX_N [PCIEs]: M.2KEYM(NGFF).47 RPI-CM1.124(PCIE_TX_N)
PCIE_TX_P [PCIEs]: M.2KEYM(NGFF).49 RPI-CM1.122(PCIE_TX_P)
PI_1V8: RPI-CM1.88(CM4_1.8V(OUTPUT)) RPI-CM1.90(CM4_1.8V(OUTPUT))
PREVGH: C16.1 D4.1(K) EINK_524352471.4
PREVGL: C14.1 D3.2(A) EINK_524352471.2
RESE: EINK_524352471.22 Q1.2(S) R9.2
RESERVED@104: RPI-CM1.104(RESERVED)
RESERVED@106: RPI-CM1.106(RESERVED)
RINPUT1: C27.2 IC3.5(RINPUT1) R39.1 U14.1(OUT)
SAM_1V1: C76.1 C77.1 C2040.23(DVDD_2) C2040.45(VREG_VOUT) C2040.50(DVDD)
SAM_3V3: BUD.1_1 BUD.1_2 BUP.1_1 BUP.1_2 BUS.1_1 BUS.1_2 C7.1 C24.2 C43.1 C44.1 C71.1 C72.1 C73.1 C74.1 C75.1 C80.1 C2040.1(IOVDD_2) C2040.10(IOVDD_3) C2040.22(IOVDD_4) C2040.33(IOVDD_5) C2040.42(IOVDD_6) C2040.43(ADC_AVDD) C2040.44(VREG_VIN) C2040.48(USB_VDD) C2040.49(IOVDD) D7.A J4.1 Q2.2(S) R16.2 R17.2 R25.2 R26.2 R28.2 R40.2 R42.2 R43.1 U5.5(VCC) U7.19(VCC) U11.5(OUT) U16.8(VCC) USB2.0MUX.9(VCC)
SAM_BOOT: Q4.1(G) RPI-CM1.29(GPIO16)
SAM_EINK_PWR: C2040.12(GPIO9) U5.2(IN_A)
SAM_EINK_SWITCH: C2040.34(GPIO22) U7.18(2OE_N) U7.20(1OE_N)
SAM_GPIO3: C2040.5(GPIO3)
SAM_GPIO4: C2040.6(GPIO4)
SAM_GPIO5: C2040.7(GPIO5)
SAM_GPIO6: C2040.8(GPIO6)
SAM_GPIO7: C2040.9(GPIO7)
SAM_GPIO8: C2040.11(GPIO8)
SAM_GPIO23: C2040.35(GPIO23)
SAM_GPIO26/ADC0: C2040.38(GPIO26/ADC0)
SAM_GPIO27/ADC1: C2040.39(GPIO27/ADC1)
SAM_GPIO28/ADC2: C2040.40(GPIO28/ADC2)
SAM_GPIO29/ADC3: C2040.41(GPIO29/ADC3)
SAM_INTERUPT: C2040.4(GPIO2) RPI-CM1.46(GPIO22) RPIBOOT12.P$1
SAM_QSPI_SCLK: C2040.52(QSPI_SCLK) U16.6(CLK)
SAM_QSPI_SCN: C2040.56(QSPI_SCN) R34.1 U16.1(!CS!)
SAM_QSPI_SD0: C2040.53(QSPI_SD0) U16.5(IO0)
SAM_QSPI_SD1: C2040.55(QSPI_SD1) U16.2(IO1)
SAM_QSPI_SD2: C2040.54(QSPI_SD2) U16.3(IO2)
SAM_QSPI_SD3: C2040.51(QSPI_SD3) U16.7(IO3)
SAM_RUN: C2040.26(RUN)
SAM_SCL: C2040.37(GPIO25) J4.3 R26.1 RPIBOOT8.P$1 U3.2(SCL) U25.2(SCL)
SAM_SDA: C2040.36(GPIO24) GND37.P$1 J4.2 R25.1 U3.1(SDA) U25.3(SDA)
SAM_SWCLK: C2040.24(SWCLK)
SAM_SWD: C2040.25(SWD)
SAM_USB_DM: C2040.46(USB_DM) R32.2
SAM_USB_DP: C2040.47(USB_DP) R31.2
SAM_USB_SWITCH: C2040.30(GPIO19) R41.1 USB2.0MUX.8(~OE)
SAM_XIN: C82.1 C2040.20(XIN) Y1.1(CRYSTAL_1)
SAM_XOUT: C2040.21(XOUT) R35.1
SCL0: CAMERA.20 RPI-CM1.80(SCL0)
SCL1: IC1.1(SCL) IC3.17(SCL) R18.1 RPI-CM1.56(GPIO3) RPIBOOT6.P$1 U6.13(SCL) U9.2(SMCLK)
SDA0: CAMERA.21 RPI-CM1.82(SDA0)
SDA1: GND7.P$1 IC1.11(SDA) IC3.18(SDA) R15.1 RPI-CM1.58(GPIO2) U6.14(SDA) U9.1(SMDATA)
SOC_EINK_BUSY: RPI-CM1.40(GPIO9) U7.17(1Y1)
SOC_EINK_CS: RPI-CM1.39(GPIO8) U7.7(1A4)
SOC_EINK_D/C: RPI-CM1.30(GPIO6) U7.5(1A3)
SOC_EINK_RESET: RPI-CM1.28(GPIO13) U7.3(1A2)
SOC_SPI_CLK: RPI-CM1.38(GPIO11) U7.10(2A1)
SOC_SPI_MOSI: RPI-CM1.44(GPIO10) U7.12(2A2)
SPI_CLK: C2040.17(GPIO14) EINK_524352471.12 RPIBOOT11.P$1 U7.8(2Y1) U21.2(I/O)
SPI_MOSI: C2040.18(GPIO15) EINK_524352471.11 GND42.P$1 U7.6(2Y2) U22.2(I/O)
SYS_PI_ON: C2040.32(GPIO21) Q3.1(G)
TACH: J3.2 R30.1 U9.6(TACH)
THERM: J1.2 SJ1.1
TS: SJ1.2 U3.10(BIN) U4.1(TS)
TSCL: EINK_524352471.19 U23.2(I/O)
TSDA: EINK_524352471.18 U24.2(I/O)
U25_OUT+: H2.1 H2.2 U25.7(OUT+)
U25_OUT-: H2.3 H2.4 U25.9(OUT-)
UART_RXD0: J5.2 RPI-CM1.51(GPIO15)
UART_RXD3_SAM: C2040.2(GPIO0) R40.1 RPI-CM1.34(GPIO5) RPIBOOT7.P$1
UART_TXD0: J5.1 RPI-CM1.55(GPIO14)
UART_TXD3_SAM: C2040.3(GPIO1) GND36.P$1 R42.1 RPI-CM1.54(GPIO4)
USB_N: J2.A7(D-) J2.B7(D-) RPI-CM1.103(USB_N) U13.5(D2-) USB2.0MUX.5(D-)
USB_OTG_ID: RPI-CM1.101(USB_OTG_ID)
USB_P: J2.A6(D+) J2.B6(D+) RPI-CM1.105(USB_P) U13.4(D2+) USB2.0MUX.3(D+)
USB_SAM_N: R32.1 USB2.0MUX.7(D1-)
USB_SAM_P: R31.1 USB2.0MUX.1(D1+)
V_BATT [BUS]: C23.1 C40.1 R12.1 RPIBOOT5.P$1 U3.7(SRN) U4.2(BAT) U4.3(BAT)
VBUS [BUS]: C3.1 C22.1 C53.1 J2.VBUS1(VBUS) J2.VBUS2(VBUS) U4.13(IN)
VCOM: C15.1 EINK_524352471.1
VDAC_COMP: RPI-CM1.111(VDAC_COMP)
VGH: C8.1 EINK_524352471.20
VGL: C5.1 EINK_524352471.21
VMID: C45.1 C47.1 IC3.27(VMID)
VOUT: C1.1 C4.1 C21.1 C26.1 C32.1 C79.1 D5.A D6.A L1.P$1 R1.2 R36.1 RPIBOOT4.P$1 T1.E U1.8(VBAT) U4.5(EN2) U4.10(OUT) U4.11(OUT) U11.1(IN) U11.3(EN) U15.1(IN) U15.3(EN)
VPP: C11.1 EINK_524352471.6
VSH: C12.1 EINK_524352471.5
VSL: C13.1 EINK_524352471.3
Unconnected: C2040.31(GPIO20) CAMERA.18 IC1.7(INT) IC1.8(DRDY) IC1.10(CS) IC3.2(LINPUT3) IC3.3(LINPUT2) IC3.4(LINPUT1) IC3.6(RINPUT2) IC3.7(RINPUT3) IC3.19(SPK_RN) IC3.22(SPK_RP) IC3.29(HP_R) IC3.30(OUT3) IC3.31(HP_L) M.2KEYM(NGFF).5 M.2KEYM(NGFF).6 M.2KEYM(NGFF).7 M.2KEYM(NGFF).8 M.2KEYM(NGFF).10 M.2KEYM(NGFF).11 M.2KEYM(NGFF).13 M.2KEYM(NGFF).17 M.2KEYM(NGFF).19 M.2KEYM(NGFF).20 M.2KEYM(NGFF).22 M.2KEYM(NGFF).23 M.2KEYM(NGFF).24 M.2KEYM(NGFF).25 M.2KEYM(NGFF).26 M.2KEYM(NGFF).28 M.2KEYM(NGFF).29 M.2KEYM(NGFF).30 M.2KEYM(NGFF).31 M.2KEYM(NGFF).32 M.2KEYM(NGFF).34 M.2KEYM(NGFF).35 M.2KEYM(NGFF).36 M.2KEYM(NGFF).37 M.2KEYM(NGFF).38 M.2KEYM(NGFF).40 M.2KEYM(NGFF).42 M.2KEYM(NGFF).44 M.2KEYM(NGFF).46 M.2KEYM(NGFF).48 M.2KEYM(NGFF).54 M.2KEYM(NGFF).56 M.2KEYM(NGFF).58 M.2KEYM(NGFF).67 M.2KEYM(NGFF).68 M.2KEYM(NGFF).69 RPI-CM1.3(ETH_PAIR3_P) RPI-CM1.4(ETH_PAIR1_P) RPI-CM1.5(ETH_PAIR3_N) RPI-CM1.6(ETH_PAIR1_N) RPI-CM1.9(ETH_PAIR2_N) RPI-CM1.10(ETH_PAIR0_N) RPI-CM1.11(ETH_PAIR2_P) RPI-CM1.12(ETH_PAIR0_P) RPI-CM1.15(ETH_!LED3) RPI-CM1.16(ETH_SYNC_IN) RPI-CM1.17(ETH_!LED2) RPI-CM1.18(ETH_SYNC_OUT) RPI-CM1.19(ETH_!LED1) RPI-CM1.20(EEPROM_!WP) RPI-CM1.24(GPIO26) RPI-CM1.31(GPIO12) RPI-CM1.35(ID_SC) RPI-CM1.36(ID_SD) RPI-CM1.37(GPIO7) RPI-CM1.41(GPIO25) RPI-CM1.45(GPIO24) RPI-CM1.47(GPIO23) RPI-CM1.48(GPIO27) RPI-CM1.50(GPIO17) RPI-CM1.57(SD_CLK) RPI-CM1.61(SD_DAT3) RPI-CM1.62(SD_CMD) RPI-CM1.63(SD_DAT0) RPI-CM1.64(SD_DAT5) RPI-CM1.67(SD_DAT1) RPI-CM1.68(SD_DAT4) RPI-CM1.69(SD_DAT2) RPI-CM1.70(SD_DAT7) RPI-CM1.72(SD_DAT6) RPI-CM1.73(SD_VDD_OVERRIDE) RPI-CM1.75(SD_PWR_ON) RPI-CM1.76(RESERVED) RPI-CM1.89(WL_!DISABLE) RPI-CM1.91(BT_!DISABLE) RPI-CM1.92(RUN_PG) RPI-CM1.94(ANALOGP1) RPI-CM1.96(ANALOGP0) RPI-CM1.99(GLOBAL_EN) RPI-CM1.100(!EXTRST) U2.1(NC) U4.7(!PGOOD!) U5.1(NC) U6.2(SDX) U6.3(SCX) U6.4(INT1) U6.9(INT2) U6.12(CS) U9.7(CLK) U9.8(!ALERT) U10.4 U11.4 U13.1(D1+) U13.2(D1-) U13.6(NC_2) U13.7(NC_3) U13.9(NC_4) U13.10(NC) U15.4 USB2.0MUX.2(D2+) USB2.0MUX.6(D2-)

## Notes on the sheet
- 5V BOOST
- R3 = 1.9Mohm for 5.2V
  R3 = 1.1Mohm for 3.3V
- 6.8uH power
  w/2A current
- See Pg 15
  1st para
- Both grounds must be connected on the PCB at only one point close to the GND pin.
- CAMERA MODULE
- EINK HiGH VOLTAGE MODULE
- OE HIGH = Disconnected
  OE LOW = Connected
  S LOW = D1
  S HIGH = D2

## Power pins joined to a net without a drawn wire
GND_2: U13.3(GND_2)

## Library data of the parts
BUD BUP BUS = EVQ-P7A01P:EVQ-P7A01P; MANUFACTURER: Panasonic Electronic Components; MAXIMUM_PACKAGE_HEIGHT: 1.35mm; PARTREV: 2022.4; STANDARD: Manufacturer Recommendations
C1-C5 C7-C19 C21-C24 C26-C36 C40 C42-C50 C53 C58-C69 C71-C77 C79 C80 C82 C83 = Capacitor:C: Capacitor - Generic; CATEGORY: Capacitor
C6 C25 = rcl:C-US: CAPACITOR, American symbol
C20 = Capacitor:C: Capacitor - Generic; CATEGORY: Capacitor; PROD_ID: CAP-13216
C2040 = 2024-03-10_01-36-20_Library:RP2040TR13; COPYRIGHT: Copyright (C) 2024 Ultra Librarian. All rights reserved.; MANUFACTURER_PART_NUMBER: RP2040TR13; MFR_NAME: Raspberry Pi
CAMERA = 2024-03-29_02-21-27_Library:524372271; COPYRIGHT: Copyright (C) 2024 Ultra Librarian. All rights reserved.; MANUFACTURER_PART_NUMBER: 524372271; MFR_NAME: Molex Connector Corporation
D1 = SparkFun-LED:LED-GREEN: Green SMD LED Used in manufacturing of various products at SparkFun Packages: 0603 - SMD 0603 package [Product Link] <http://www.futureelectronics.com/en/technologies/semiconductors/optoelectronics/leds/Pages/9894312-LTST-C190GKT.aspx?CrossPart=HSMG-C190&IM=0> LilyPad 1206 - SMD1206 LilyPad package [Product Link] <http://www.futureelectronics.com/en/Technologies/Product.aspx?ProductID=IN150NGHARVATEKCORPORATION2049943&IM=0> 1206 - SMD1206 package [Product Link] <http://www.futureelectronics.com/en/technologies/semiconductors/optoelectronics/leds/Pages/8315665-LTST-C150KGKT.aspx?IM=0> 1206 Bottom Mount -SMD 1206 Bottom Mount [Product Link] <http://www.digikey.com/product-detail/en/lite-on-inc/LTST-C230KGKT/160-1456-1-ND/386854> SparkFun Products: Pro Mini 328 -5V <https://www.sparkfun.com/products/821> RedBoard <https://www.sparkfun.com/products/12757> MP3 Trigger <https://www.sparkfun.com/products/13720> Makey Makey <https://www.sparkfun.com/products/11076>; PROD_ID: DIO-00821; VALUE: GREEN
D2-D4 = MBR0530:MBR0530: ON SEMICONDUCTOR - MBR0530 - DIODE, SCHOTTKY, 0.5A, 30V, SOD-123 Source: Datasheet <http://www.onsemi.com/pub/Collateral/MBR0530T1-D.PDF> Check availability <https://pricing.snapeda.com/parts/MBR0530/ON%20Semiconductor/view-part?ref=eda>; AVAILABILITY: In Stock; CHECK_PRICES: https://www.snapeda.com/parts/MBR0530/Onsemi/view-part/?ref=eda; DESCRIPTION: Diode Schottky 30 V 500mA Surface Mount SOD-123; MF: ON Semiconductor; MP: MBR0530; PACKAGE: SOD-123-2 ON Semiconductor; PRICE: None; PURCHASE-URL: https://www.snapeda.com/api/url_track_click_mouser/?unipart_id=179458&manufacturer=ON Semiconductor&part_name=MBR0530&search_term=None; SNAPEDA_LINK: https://www.snapeda.com/parts/MBR0530/Onsemi/view-part/?ref=snap
D5 = SparkFun-LED:LED-BLUE: Blue SMD LED Used in manufacturing of various products at SparkFun Packages: 0603 - SMD 0603 package [Product Link] <http://www.digikey.com/product-detail/en/SMLE12BC7TT86/511-1589-2-ND/1641808> 1206 - SMD1206 package [Product Link] <http://www.digikey.com/product-detail/en/lite-on-inc/LTST-C150TBKT/160-1643-1-ND/573584> SparkFun Products: ESP8266 Thing-Dev Board <https://www.sparkfun.com/products/13711> RedBoard <https://www.sparkfun.com/products/12757>; PROD_ID: DIO-08575; VALUE: BLUE
D6 D7 = SparkFun-LED:LED-RED: Red SMD LED Used in manufacturing of most products at SparkFun Packages: 0603 - SMD 0603 package [Product Link] <http://docs.avagotech.com/docs/AV02-0551EN> 0603 SMART - SMD 0603 SMART package ( more efficient and expensive)[Product Link] <http://www.osram-os.com/Graphics/XPic2/00077099_0.pdf> 1206 - SMD1206 package [Product Link] <https://www.sparkfun.com/datasheets/DevTools/LilyPad/Q150OVS4.pdff> SparkFun Products: Pro Mini 328 -5V <https://www.sparkfun.com/products/821> RedBoard <https://www.sparkfun.com/products/12757> IOIO-OTG <https://www.sparkfun.com/products/13613>; PROD_ID: DIO-00819; VALUE: RED
EINK_524352471 = 2024-02-19_09-48-43_Library:524372471; COPYRIGHT: Copyright (C) 2024 Ultra Librarian. All rights reserved.; DIGI-KEY_PART_NUMBER_1: WM7980TR-ND; DIGI-KEY_PART_NUMBER_2: WM7980CT-ND; DIGI-KEY_PART_NUMBER_3: WM7980DKR-ND; MANUFACTURER_PART_NUMBER: 524372471; MFR_NAME: Molex Connector Corporation
FB1-FB3 FB5 = Filter:FB: Ferrite Bead - Generic; CATEGORY: Filter; SUB-CATEGORY: Ferrite bead
GND GND7 GND13 GND22 GND26 GND27 GND34 GND36 GND37 GND40-GND42 RPIBOOT RPIBOOT1-RPIBOOT12 USB_BOOT_N = SparkFun-Connectors:TEST-POINT: SparkFun Test Points Bare copper test points for troubleshooting or In-Circuit-Testing. These are used by our Production team for verifying production board runs using pogo-pins on test beds. SparkFun Products: SparkFun LSM9DS1 Breakout <https://www.sparkfun.com/products/13284> SparkFun PSOC <https://www.sparkfun.com/products/13714> SparkFun Load Cell Amplifier <https://www.sparkfun.com/products/13879>
H2 J3-J5 = 2024-05-18_10-24-10_Library:BM04B-SRSS-TB; COPYRIGHT: Copyright (C) 2024 Ultra Librarian. All rights reserved.; MANUFACTURER_PART_NUMBER: BM04B-SRSS-TB; MFR_NAME: JST; TYPE: Headers, Male Pins
IC1 = adafruit_sensor:LIS3MDL: Digital output magnetic sensor. ultra-low-power, high-performance 3-axis magnetometer
IC3 = microbuilder:WM8960
J1 = 2024-05-21_05-27-43_Library:SM03B-SRSS-TB; COPYRIGHT: Copyright (C) 2024 Ultra Librarian. All rights reserved.; MANUFACTURER_PART_NUMBER: SM03B-SRSS-TB; MFR_NAME: JST
J2 = SparkFun-Connectors:USB_C: USB Type C 16Pin Connector Super Speed pins not available on the 16-pin purely SMD connector so this part is best for USB 2.0 implementations. D1 and D2 are tied together enabling D+/- no matter which way the cable is plugged into the connector. The two channel configuration pins (CC1/2) are exposed. These are normally connected to ground via 5.1k resistors but can be reconfigured for high current/high power applications.; PROD_ID: CONN-14122
L1 = microbuilder:INDUCTOR: Inductors 0603: 10nH Ceramic Inductor - microwire antenna/RF (Digikey: 712-1434-2-ND) 0805: 560nH Ceramic Inductor - RF (Digikey: 553-1047-1-ND) 270nH Ceramic Inductor - Q = 40@250MHz, +-5%, 1 Ohm DC Resistance (Digikey: 535-10506-2-ND) 1007 (2518 Metric) SMT: 10µH 10% 250mOhm 820mA 1007 Inductor (Digikey: 587-2189-1-ND) 22µH 10% 500mOhm 580mA 1007 Inductor (Digikey: 587-2190-1-ND) 47µH 10% 950mOhm 420mA 1007 Inductor (Digikey: 587-2191-1-ND) 47µH 5% 100mOhm 1A 1008 Inductor (Digikey: 732-1816-1-ND) 5.0x5.0mm (Taiyo Yuden NR5040 Series) 6.8µH 20% 2.3A 64mOhm Inductor (Digikey: 587-2374-2-ND) 5.0x5.0mm (TDK VLC5045 Series) 4.7µH 20% 3.3A 34mOhm Inductor (Digikey: 445-6526-1-ND) 6.8µH 20% 2.7A 46mOhm Inductor (Digikey: 445-6527-1-ND) 6.0x6.0mm (TDK VLC6045 Series) 4.7µH 20% 3.8A 27mOhm Inductor (Digikey: 445-6538-2-ND) 6.8µH 20% 3A 41mOhm Inductor (Digikey: 445-6540-1-ND) 6.2µH 30% 2.2A 45mOhm Inductor (Digikey: SRR5028-6R2YCT-ND) - Not TDK VLC6045 but footprint should match 6.0x6.0mm (TDK SLF6045 Series) 6.8uH 30% 2A 33mOhm Inductor (Digikey: 445-4572-1-ND, Mouser: 810-SLF645T6R8N2R0PF) 6.0x6.0mm (Sumida CDRH5D28 Series) 6.2uH 30% 1.8A 45mOhm Inductor (Digikey: 308-1542-1-ND) Taiyo Yuden NR3015T2R2M - 2.2uH 20% 1.5A (Digikey: 587-1648-2-ND, Mouser: 963-NR3015T2R2M) - Used with TI TPS62172 CoilCraft RFID Transponder Coil - MA5532-AE (For use with AS3935 Lightning Sensor) Vishay IHLP 1.0uH Molded Inductor - 24mOhm DCR, 5A, +/-20%, -55°C-125°C (Digikey: 541-1319-1-ND)
L3 = LQH5BPN2R2NT0L:LQH5BPN2R2NT0L: Inductor Power Chip Shielded Wirewound 1.2uH 30% 100KHz Ferrite 3.1A 0.0228Ohm DCR 2020 T/R; MANUFACTURER: Murata; MAXIMUM_PACKAGE_HEIGHT: 2.2 mm; PARTREV: N/A; STANDARD: Manufacturer Recommendations
LED2 LOW_BATT = LED:CHIP-ROUND-R: LED - Generic; CATEGORY: LED; COLOR: RED; DESCRIPTION: CHIP LED ROUND; SUB-CATEGORY: CHIP; TYPE: ROUND_TOP
LED3 = SparkFun-LED:LED: LED (Generic) Standard schematic elements and footprints for 5mm, 3mm, 1206, and 0603 sized LEDs. Generic LEDs with no color specified.
LS1 = CMS-18138A-SP:CMS-18138A-SP: 18 x 13 x 2.5 mm 300 to 1150 Hz 92 dB Spring Lead Low Profile Micro Speaker Check availability <https://pricing.snapeda.com/parts/CMS-18138A-SP/CUI%20Devices/view-part?ref=eda>; AVAILABILITY: In Stock; CHECK_PRICES: https://www.snapeda.com/parts/CMS-18138A-SP/CUI+Devices/view-part/?ref=eda; CUI_PURCHASE_URL: https://www.cuidevices.com/product/audio/speakers/miniature-(10-mm~40-mm)/cms-18138a-sp?utm_source=snapeda.com&utm_medium=referral&utm_campaign=snapedaBOM; DESCRIPTION: 18 x 13 mm, Rectangular Frame, 0.8 W, 8 Ohm, Neodymium Magnet, PEEK Cone, Speaker; MF: CUI Devices; MP: CMS-18138A-SP; PACKAGE: None; PRICE: None; PURCHASE-URL: https://www.snapeda.com/api/url_track_click_mouser/?unipart_id=2680118&manufacturer=CUI Devices&part_name=CMS-18138A-SP&search_term=None; SNAPEDA_LINK: https://www.snapeda.com/parts/CMS-18138A-SP/CUI+Devices/view-part/?ref=snap
M.2KEYM(NGFF) = 1-2199119-5:1-2199119-5: M.2 0.5PITCH 3.2H KEY M 15U'' AU; CHECK_PRICES: https://www.snapeda.com/parts/1-2199119-5/TE+Connectivity+AMP+Connectors/view-part/?ref=eda; COMMENT: 1-2199119-5; DESCRIPTION: M.2 0.5PITCH 3.2H KEY M 15Uinch AU, M.2 Connectors | TE Connectivity 1-2199119-5; DIGIKEY_PART_NUMBER: A115902TR-ND; MF: TE Connectivity; MP: 1-2199119-5; PACKAGE: None; SNAPEDA_LINK: https://www.snapeda.com/parts/1-2199119-5/TE+Connectivity+AMP+Connectors/view-part/?ref=snap
OSC2 = microbuilder:OSCILLATOR: Oscillators 3.2x2.5mm SMT 4.0MHz +/- 50ppm, 3.3V, 9mA, -40/+85°C - Digikey: 535-9752-1-ND 50MHz +/- 50ppm, 3.3V, 8mA, -10/+70°C - Digikey: 478-4792-1-ND 5x7mm SMT 4.0MHz +/-20ppm 3.3V, 20mA, -20/+70°C - Digikey: 535-9329-2-ND 50MHz +/- 25ppm 3.3V, 35mA, -40/+85°C - Digikey: 631-1197-1-ND
Q1 = SI1308EDL-T1-GE3:SI1308EDL-T1-GE3: MOSFET N-Ch 30V 1.5A TrenchFET SC70 Vishay Si1308EDL-T1-GE3 N-channel MOSFET Transistor, 1.5 A, 30 V, 3-Pin SC-70 Source: Datasheet <https://componentsearchengine.com/Datasheets/1/SI1308EDL-T1-GE3.pdf> Check availability <https://pricing.snapeda.com/parts/SI1308EDL-T1-GE3/Vishay%20Siliconix/view-part?ref=eda>; AVAILABILITY: In Stock; CHECK_PRICES: https://www.snapeda.com/parts/SI1308EDL-T1-GE3/Vishay+Siliconix/view-part/?ref=eda; DESCRIPTION: Si1308EDL-T1-GE3 N-channel MOSFET Transistor, 1.5 A, 30 V, 3-Pin SC-70 | Siliconix / Vishay SI1308EDL-T1-GE3; MF: Vishay Siliconix; MP: SI1308EDL-T1-GE3; PACKAGE: SOT-323 Vishay Semiconductor; PRICE: None; PURCHASE-URL: https://www.snapeda.com/api/url_track_click_mouser/?unipart_id=274603&manufacturer=Vishay Siliconix&part_name=SI1308EDL-T1-GE3&search_term=si1308edl; SNAPEDA_LINK: https://www.snapeda.com/parts/SI1308EDL-T1-GE3/Vishay+Siliconix/view-part/?ref=snap
Q2 = DMG2307L:DMG2307L: MOSFET, P CH, 30V, 3.8A, SOT23; Transistor Polarity: P Channel; Continuous Drain Current Id: -4.6A; Drain Source Volt... Check availability <https://pricing.snapeda.com/parts/DMG2307L/Diodes%20Inc./view-part?ref=eda>; AVAILABILITY: In Stock; CHECK_PRICES: https://www.snapeda.com/parts/DMG2307L/Diodes+Inc./view-part/?ref=eda; DESCRIPTION: P-Channel 30 V 2.5A (Ta) 760mW (Ta) Surface Mount SOT-23-3; MF: Diodes Inc.; MP: DMG2307L; PACKAGE: SOT-23 Diodes Inc.; PRICE: None; SNAPEDA_LINK: https://www.snapeda.com/parts/DMG2307L/Diodes+Inc./view-part/?ref=snap
Q3 Q4 = Transistor:NMOSFET: N-Channel MOSFET - Generic; CATEGORY: Transistor; SUB-CATEGORY: MOSFET; TYPE: N-Channel; VALUE: NMOSFET
R1-R5 R8-R11 R13-R28 R30-R44 = Resistor:R-US: Resistor Fixed - ANSI; CATEGORY: Resistor; SUB-CATEGORY: Fixed
R6 = Resistor:R-US: Resistor Fixed - ANSI; CATEGORY: Resistor; PROD_ID: RES-13217; SUB-CATEGORY: Fixed
R7 = Resistor:R-US: Resistor Fixed - ANSI; CATEGORY: Resistor; PROD_ID: RES-10447; SUB-CATEGORY: Fixed
R12 = SparkFun-Resistors:RESISTOR: Resistor Basic schematic elements and footprints for 0603, 1206, and PTH resistors.; PROD_ID: RES-13218
RPI-CM1 = RPI-CM4:RPI-CM4
SJ1 SJ6 = SparkFun-Passives:JUMPER-PAD-2-NC_BY_TRACE
T1 = transistor:*-PNP_DRIVER-: PNP Bias Resistor Transistor
U1 = microbuilder:VREG_TPS6103X: TPS6103x 4A Boost - 1.8-5.5V Input, Adjustable Output to 5.5V
U2 U5 = MC74VHC1G14DFT1G:MC74VHC1G14DFT1G: Single Schmitt-Trigger Inverter Check availability <https://pricing.snapeda.com/parts/MC74VHC1G14DFT1G/ON%20Semiconductor/view-part?ref=eda>; AVAILABILITY: In Stock; CHECK_PRICES: https://www.snapeda.com/parts/MC74VHC1G14DFT1G/Onsemi/view-part/?ref=eda; DESCRIPTION: MC74VHC1G14DFT1G Schmitt Trigger Inverter, 2 - 5.5 V, 5-Pin SC-88A | ON Semiconductor MC74VHC1G14DFT1G; MF: ON Semiconductor; MP: MC74VHC1G14DFT1G; PACKAGE: SC-88A-5 ON Semiconductor; PRICE: None; SNAPEDA_LINK: https://www.snapeda.com/parts/MC74VHC1G14DFT1G/Onsemi/view-part/?ref=snap
U3 = battery-management-temp:BQ27441-G1; PROD_ID: IC-13220
U4 = battery-management-temp:BQ24075; PROD_ID: IC-13219
U6 = adafruit_sensor:LSM6DS3
U7 = 2024-05-18_09-46-26_Library:SN74LVC244ARWPR; COPYRIGHT: Copyright (C) 2024 Ultra Librarian. All rights reserved.; MANUFACTURER_PART_NUMBER: SN74LVC244ARWPR; MFR_NAME: Texas Instruments; REFDES: RefDes; TYPE: TYPE
U9 = 2024-03-07_04-01-04_Library:EMC2301-1-ACZL-TR; COPYRIGHT: Copyright (C) 2024 Ultra Librarian. All rights reserved.; MANUFACTURER_PART_NUMBER: EMC2301-1-ACZL-TR; MFR_NAME: Microchip
U10 U11 U15 = microbuilder:VREG_SOT23-5: SOT23-5 Fixed Voltage Regulators Part Current Out V Out V In V Dropout θJA (°C/W) TJ (°C) Digikey Part No. ADP121 150mA 3.3V 3.4-5.5V 0.09V @ 150mA -- -- ADP121-AUJZ33R7CT-ND ADP121 150mA 3.0V 3.1-5.5V 0.09V @ 150mA -- -- ADP121-AUJZ30R7CT-ND ADP122 300mA 3.3V 3.4-5.5V 0.085V @ 300mA -- -- ADP122AUJZ-3.3-R7CT-ND ADP1712 300mA 3.3V 3.5-5.5V 0.17V @ 300mA -- -- ADP1712AUJZ-3.3-R7TR-ND AP7311 (Low Cost) 150mA 3.3V 3.5-6V 0.15V @ 150mA -- -- AP7311-33WG-7DICT-ND LD39015M18R 150mA 1.8V 1.9V-5.5V 0.08V @ 100mA -- -- 497-6977-1-ND LP2985A-33DBVR 150mA 3.3V 3.3-16V 0.28V @ 150mA 206 150 296-18479-1-ND MCP1824T-3302E/OT 300mA 3.3V 3.5V-6V 0.2V @ 300mA -- -- MCP1824T-3302E/OTCT-ND MIC5205-2.5YM5 TR 150mA 2.5V 2.7-16V 0.165V @ 150mA -- -- 576-1257-2-ND MIC5205-3.0YM5 TR 150mA 3.0V 3.2V-16V 0.165V @ 150mA -- -- 576-1258-2-ND MIC5205-3.3YM5 TR 150mA 3.3V 3.5V-16V 0.165V @ 150mA -- -- 576-1259-2-ND TPS780330220 150mA 3.3V+2.2V 3.6-5.5V 250mV Max -- -- 296-23332-1-ND TDA3663/N1,135 100mA 3.3V 3.5-45V 0.18V @ 50mA -- -- 568-5343-1-ND Max operating temp can be calculated using θJA, TJ (max junction temperature), and power in watts. Set the "Maximum Ambient Temperature" until it reaches TJ ("Max Junction Temperature"), which is the absolute limit for safe use of the regulator: Heat Sink Temperature Calculator <http://www.daycounter.com/Calculators/Heat-Sink-Temperature-Calculator.phtml> For example, With 12V source into a 3.3V LP2985 and a 30mA load, we are dissipating (12V-3.3V) * 0.03A = 0.261W. With a θJA of 206 °C/W, a TJ of 150°C, and 261mW we can safely use the chip without a heat sink up to 75°C (=147.1°C Junction Temperature).
U12 = SPU0410LR5H-QB:SPU0410LR5H-QB: 100Hz ~ 80kHz Analog Microphone MEMS (Silicon) 1.5V ~ 3.6V Omnidirectional (-38dB ±3dB @ 94dB SPL), SMD; MANUFACTURER: KNOWLES; PARTREV: H; STANDARD: Manufacturer Recommendations
U13 = 2024-03-29_01-35-38_Library:TPD4EUSB30DQAR; COPYRIGHT: Copyright (C) 2024 Ultra Librarian. All rights reserved.; MANUFACTURER_PART_NUMBER: TPD4EUSB30DQAR; MFR_NAME: Texas Instruments
U14 = SparkFun-IC-Amplifiers:OPA344: Single gate rail-to-rail output op-amp. Inputs extend 300mV past rails. Datasheet <http://www.ti.com/product/OPA344> SparkFun Products SparkFun Low Current Sensor <https://www.sparkfun.com/products/8883> (SEN-08883) SparkFun Electret Microphone Breakout <https://www.sparkfun.com/products/12758> (BOB-12758); PROD_ID: IC-08251
U16 = W25Q16JVUXIQ_TR:W25Q16JVUXIQ_TR: None; MANUFACTURER: Winbond; PACKAGE: PSON50P300X200X60-9N
U17-U24 = 2024-05-19_00-17-33_Library:TPD1E1B04DPYR; COPYRIGHT: Copyright (C) 2024 Ultra Librarian. All rights reserved.; MANUFACTURER_PART_NUMBER: TPD1E1B04DPYR; MFR_NAME: Texas Instruments
U25 = DRV2605LDGSR:DRV2605LDGSR: Haptic Driver for ERM and LRA with Built-In Library and Smart Loop Architecture 10-VSSOP -40 to 85; MANUFACTURER: Texas Instruments; MAXIMUM_PACKAGE_HEIGHT: 1.1 mm; PARTREV: D; STANDARD: IPC-7351B
USB2.0MUX = microbuilder:TS3USB30RSWR: 1:2 MULTIPLEXER/DEMULTIPLEXER SWITCH WITH SINGLE ENABLE; DESCRIPTION: High-speed USB 2.0 (480-Mbps) 1:2 multiplexer & demultiplexer switch with single enable; DIGI-KEY_PART_NUMBER: 296-22547-2-ND; MF: Texas Instruments; MP: TS3USB30RSWR; PACKAGE: UQFN-10 Texas Instruments; PURCHASE-URL: https://pricing.snapeda.com/search?q=TS3USB30RSWR&ref=eda
Y1 = ABM8-272-T3:ABM8-272-T3: Crystal, 12 MHz, SMD, 3.2mm x 2.5mm, 30 ppm, 10 pF, 30 ppm, ABM8 Series Source: Datasheet <https://abracon.com/datasheets/ABM8-272-T3.pdf>; DESCRIPTION: Crystal, 12 MHz, SMD, 3.2mm x 2.5mm, 30 ppm, 10 pF, 30 ppm, ABM8 Series; HEIGHT: 0.8mm; MANUFACTURER_NAME: ABRACON; MANUFACTURER_PART_NUMBER: ABM8-272-T3; MOUSER_PART_NUMBER: 815-ABM8-272-T3; MOUSER_PRICE-STOCK: https://www.mouser.co.uk/ProductDetail/ABRACON/ABM8-272-T3?qs=QpmGXVUTftEj6miOiJBMxQ%3D%3D

## Net classes
0 default: width 0.089 mm, clearance 0.152 mm
1 BUS: width 0.305 mm, drill 0.3 mm
2 1A: width 0.305 mm, drill 0.3 mm
3 PCIEs: width 0.191 mm, clearance 0.089 mm